# EAGLE design ChakraPendant (EAGLE 7.2.0)
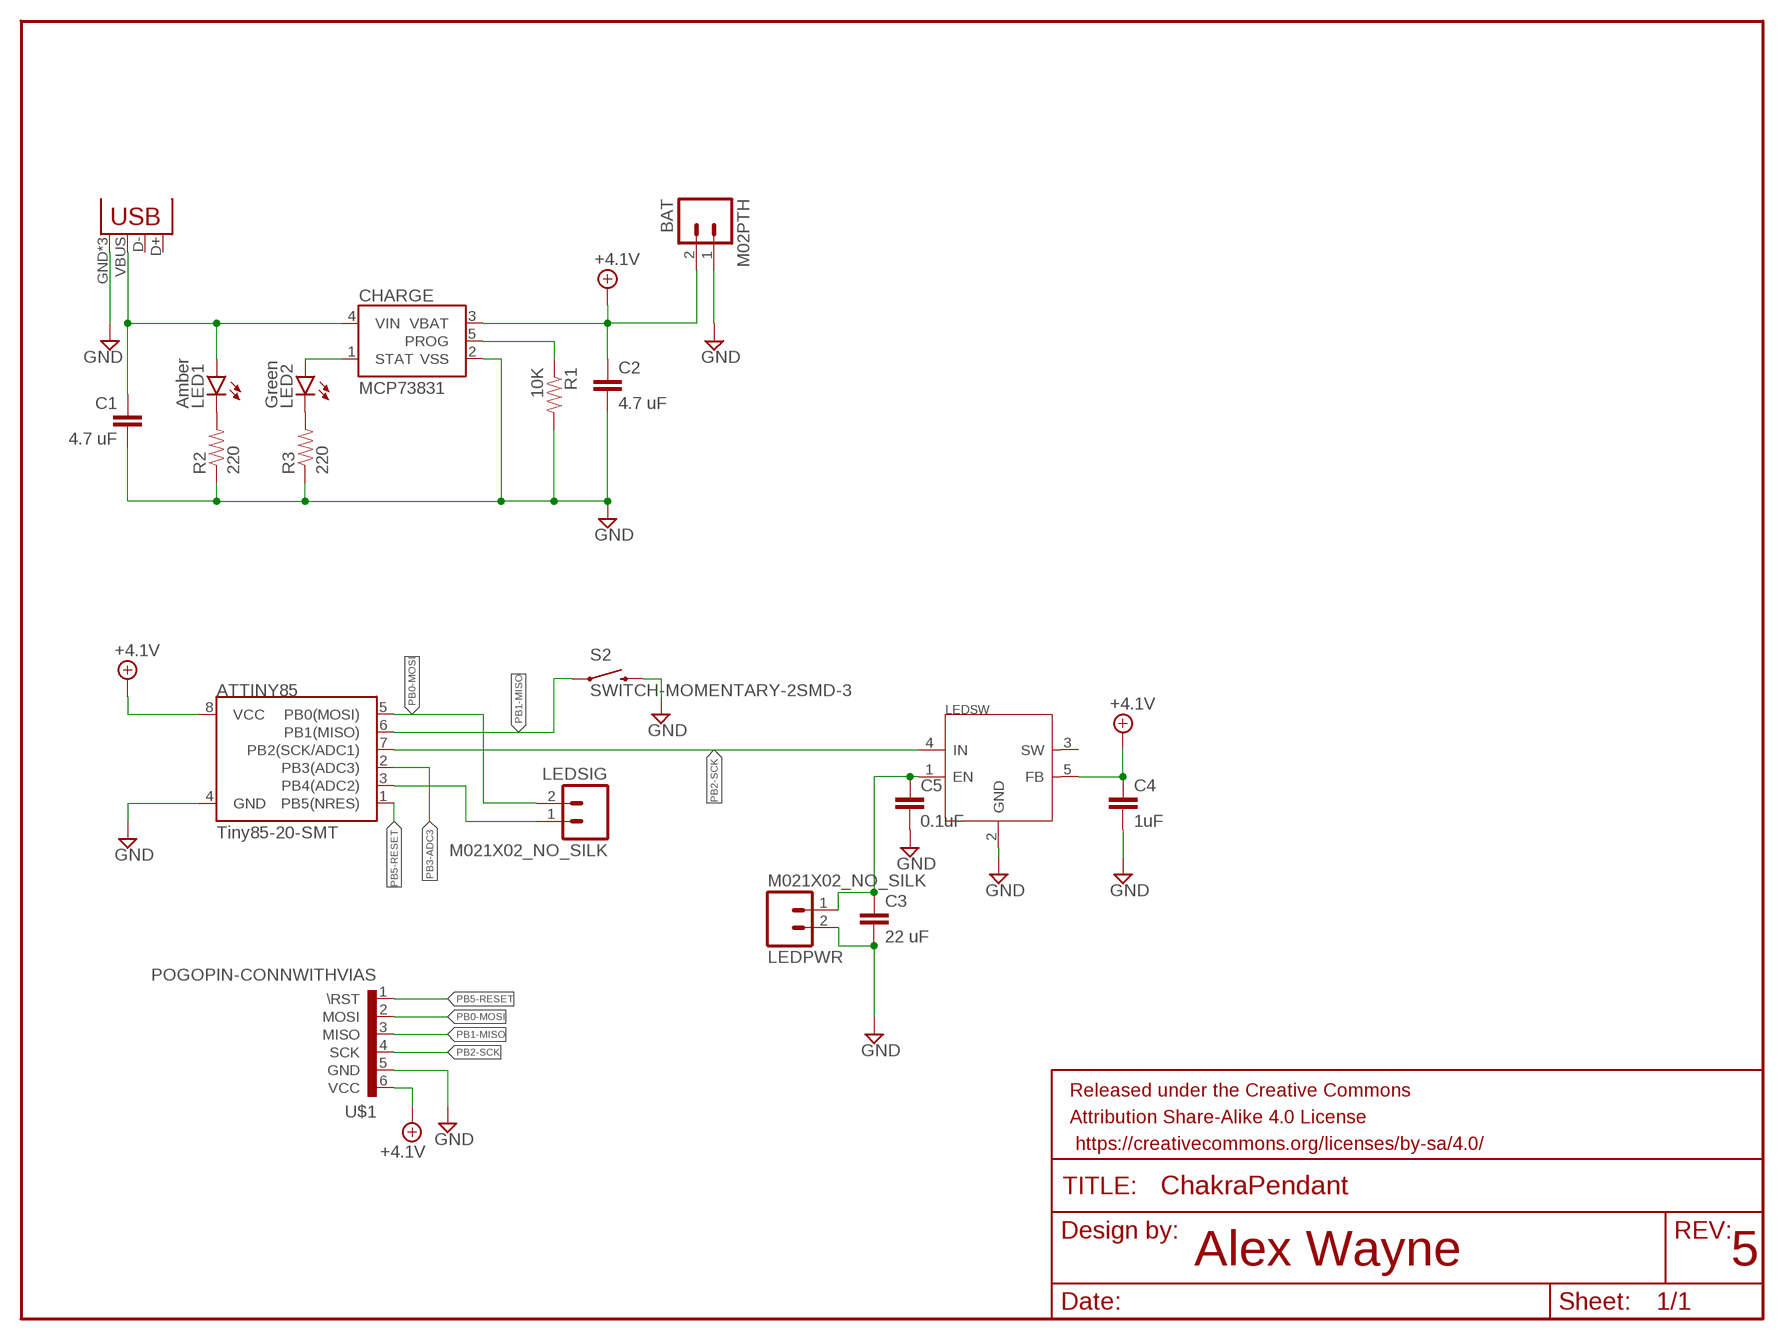
[diagram p0: schematic, sheet 1]

## Parts
ATTINY85  Tiny85-20-SMT  ATTINY45TINY85-20-SMT  [SO08-EIAJ]
BAT  M02PTH  [1X02]
C1  4.7 uF  CAP0603-CAP  [0603-CAP]
C2  4.7 uF  CAP0603-CAP  [0603-CAP]
C3  22 uF  CAP1206  [1206]
C4  1uF  CAP0603-CAP  [0603-CAP]
C5  0.1uF  CAP0603-CAP  [0603-CAP]
CHARGE  MCP73831  [SOT23-5]
FRAME1  FRAME-LETTER  [CREATIVE_COMMONS]
JP1  USB-MICROB  [USB-MICROB]
LED1  Amber  LED0603  [LED-0603]
LED2  Green  LED0603  [LED-0603]
LEDPWR  M021X02_NO_SILK  [1X02_NO_SILK]
LEDSIG  M021X02_NO_SILK  [1X02_NO_SILK]
LEDSW  ETA3406  [SOT23-5]
R1  10K  RESISTOR0603-RES  [0603-RES]
R2  220  RESISTOR0603-RES  [0603-RES]
R3  220  RESISTOR0603-RES  [0603-RES]
S2  SWITCH-MOMENTARY-2SMD-3  [TACTILE_SWITCH_SMD-3]
U$1  POGOPIN-CONNWITHVIAS  [POGOPROG-CONN-0H]

## Nets
+4.1V [supply]: ATTINY85.8(VCC) BAT.2 C2.1 C4.1 CHARGE.3(VBAT) LEDSW.5(FB) U$1.6(VCC)
GND [supply]: ATTINY85.4(GND) BAT.1 C1.2 C2.2 C3.2 C4.2 C5.2 CHARGE.2(VSS) JP1.GND JP1.MT1(GND) JP1.MT2(GND) LEDPWR.2 LEDSW.2(GND) R1.2 R2.1 R3.1 S2.4 U$1.5(GND)
N$3: ATTINY85.3(PB4(ADC2)) LEDSIG.1
N$4: LED1.C R2.2
N$5: LED2.C R3.2
N$6 [supply]: C3.1 C5.1 LEDPWR.1 LEDSW.1(EN)
PB0-MOSI: ATTINY85.5(PB0(MOSI)) LEDSIG.2 U$1.2(MOSI)
PB1-MISO: ATTINY85.6(PB1(MISO)) S2.1 U$1.3(MISO)
PB2-SCK: ATTINY85.7(PB2(SCK/ADC1)) LEDSW.4(IN) U$1.4(SCK)
PB3-ADC3: ATTINY85.2(PB3(ADC3))
PB5-RESET: ATTINY85.1(PB5(NRES)) U$1.1(\RST)
PROG: CHARGE.5(PROG) R1.1
STAT: CHARGE.1(STAT) LED2.A
USB5V [supply]: C1.1 CHARGE.4(VIN) JP1.VBUS LED1.A
Unconnected: JP1.D+ JP1.D- LEDSW.3(SW)

## Notes on the sheet
- Alex Wayne | 5

## Library data of the parts
ATTINY85 = SparkFun-DigitalIC:ATTINY45: Atmel 8-pin 2/4/8kB flash uC; PROD_ID: IC-09092
BAT LEDPWR LEDSIG = SparkFun-Connectors:M02: Standard 2-pin 0.1" header. Use with - straight break away headers ( PRT-00116) - right angle break away headers (PRT-00553) - swiss pins (PRT-00743) - machine pins (PRT-00117) - female headers (PRT-00115) Molex polarized connector foot print use with: PRT-08233 with associated crimp pins and housings. 2.54_SCREWTERM for use with PRT-10571. 3.5mm Screw Terminal footprints for PRT-08084 5mm Screw Terminal footprints for use with PRT-08432
C1-C5 = SparkFun-Passives:CAP: Capacitor Standard 0603 ceramic capacitor, and 0.1" leaded capacitor.
CHARGE = SparkFun-PowerIC:MCP73831: Miniature single cell, fully integrated Li-Ion, Li-polymer charge management controller http://ww1.microchip.com/downloads/en/DeviceDoc/21984a.pdf IC-09995; PROD_ID: IC-09995
FRAME1 = SparkFun-Aesthetics:FRAME-LETTER: Schematic Frame Standard 8.5x11 US Letter frame
JP1 = SparkFun-Connectors:USB: USB Connectors USB-B-PTH is fully proven SKU : PRT-00139/CONN-08278 USB-miniB is fully proven SKU : PRT-00587 USB-A-PCB is untested. USB-A-H is throughly reviewed, but untested. Spark Fun Electronics SKU : PRT-00437 USB-B-SMT is throughly reviewed, but untested. Needs silkscreen touching up. USB-A-S has not been used/tested USB-MB-H has not been used/tested USB-MICROB has been used. CONN-09505; PROD_ID: CONN-09505
LED1 LED2 = SparkFun-LED:LED: LEDs Standard schematic elements and footprints for 5mm, 3mm, 1206, and 0603 sized LEDs. 5mm - Spark Fun Electronics SKU : COM-00529 (and others)
LEDSW = IC:ETA3406: 1.5MHZ 1.2A Step-Down Converter in SOT23-5 Package
R1-R3 = SparkFun-Passives:RESISTOR: Resistor Basic schematic elements and footprints for 0603, 1206, and PTH resistors.
S2 = SparkFun-Electromechanical:SWITCH-MOMENTARY-2: Various NO switches- pushbuttons, reed, etc
U$1 = Protofusion:POGOPIN-CONN: Protofusion custom pogo pin programming header

## Net classes
0 default: width 0.254 mm
1 supply: width 0.508 mm

## Board
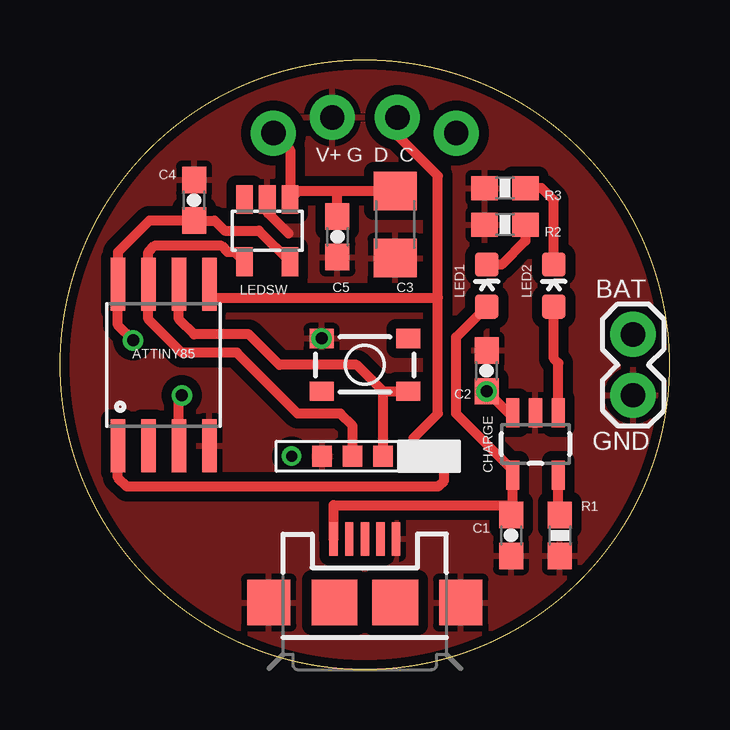
[diagram p1: board, top side]
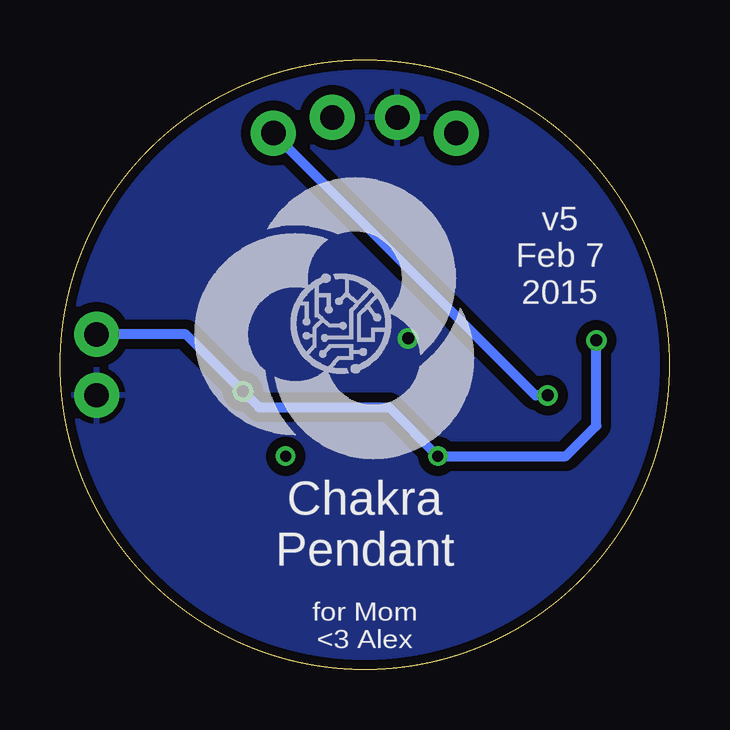
[diagram p2: board, bottom side, seen from below]

Size 25.4 x 25.4 mm. Coordinates in mm from the lower left corner, seen from the top.
Outline: circle at 12.7,12.7 radius 12.7
Copper layers (1*16): Top 0.0356mm / dielectric 1.5011mm / Bottom 0.0356mm
Design rules "oshpark-2layer *": minimum track width 6mil, minimum drill 13mil, track to track 6mil, track to pad 6mil, pad to pad 6mil, via to via 6mil, smd to smd 6mil, copper to edge 15mil, drill to drill 6mil, minimum pad ring 7mil, minimum via ring 7mil, stop-mask expansion 4mil, vias tented up to drill 0mil, thermal gap 10mil

### Footprints (pad centres in the part's own frame; a part is rotated, then mirrored left to right if it is on the bottom)
SO08-EIAJ = smd 0.61 x 2.21: 1 -1.905,-3.378; 2 -0.635,-3.378; 3 0.635,-3.378; 4 1.905,-3.378; 5 1.905,3.353; 6 0.635,3.353; 7 -0.635,3.353; 8 -1.905,3.353
1X02 = drill 1.016 pad 1.88: 1 0,0; 2 2.54,0
0603-CAP = smd 1.1 x 1: 1 -0.85,0; 2 0.85,0
1206 = smd 1.6 x 1.8: 1 -1.4,0; 2 1.4,0
SOT23-5 = smd 0.55 x 1.2: 1 -0.95,-1.3; 2 0,-1.3; 3 0.95,-1.3; 4 0.95,1.3; 5 -0.95,1.3
USB-MICROB = smd 0.35 x 1.4: D+ 0,2.65; D- -0.65,2.65; GND 1.3,2.65; ID 0.65,2.65; VBUS -1.3,2.65 | smd 1.8 x 1.9: MT1 -4,0; MT2 4,0 | smd 1.9 x 1.9: P$1 -1.27,0; P$2 1.27,0
LED-0603 = smd 1 x 1: A 0,-0.877; C 0,0.877
1X02_NO_SILK = drill 1.016 pad 1.88: 1 0,0; 2 2.54,0
SOT23-5' = smd 0.69 x 1.2: 1 -0.95,-1.3; 2 0,-1.3; 3 0.95,-1.3; 4 0.95,1.3; 5 -0.95,1.3
0603-RES = smd 1.1 x 1: 1 -0.85,0; 2 0.85,0
TACTILE_SWITCH_SMD-3 = smd 1 x 0.8: 1 -1.8,1.1; 2 1.8,1.1; 3 -1.8,-1.1; 4 1.8,-1.1
POGOPROG-CONN-0H = drill 0.457: 1 0,3.81; 6 0,-2.54 | smd 0.889 x 0.813: 2 0,2.54; 3 0,1.27; 4 0,0; 5 0,-1.27

### Placement (x,y rotation side)
ATTINY85  4.32,12.7 0 top
BAT  23.88,11.43 90 top
C1  18.8,5.59 270 top
C2  17.78,12.45 90 top
C3  13.97,18.54 270 top
C4  5.59,19.56 90 top
C5  11.56,18.03 270 top
CHARGE  19.81,9.4 180 top
FRAME1  20.83,-21.08 0 top  (outside the outline)
JP1  12.7,2.79 0 top
LED1  17.78,16 0 top
LED2  20.57,16 0 top
LEDPWR  8.89,22.35 15 top
LEDSIG  16.51,22.35 165 top
LEDSW  [SOT23-5']  8.64,18.29 180 top
R1  20.83,5.59 270 top
R2  18.54,18.54 0 top
R3  18.54,20.07 0 top
S2  12.7,12.7 180 top
U$1  12.19,8.89 270 top

### Tracks (layer width: path | path; a pad name or v marks a point on that pad's centre or on a via)
+4.1V  (via drill 0.5)
  Top 0.406: CHARGE.3 18.68,10.7 C2.1 | v3.05,13.72 2.41,14.35 ATTINY85.8 2.41,17.4 3.72,18.71 C4.1 6.44,18.71 6.86,18.29 8.29,18.29 LEDSW.5
  Bottom 0.406: BAT.2 20.15,13.97 C2.1 17.11,10.92 11.68,10.92 U$1.6 4.32,8.89 3.05,10.16 v3.05,13.72
  other vias: 17.78,11.6
GND  (via drill 0.5)
  Top 0.406: LEDSW.2 8.64,19.05 9.53,18.16
  other vias: 10.9,13.8
  pour Top (isolate 0.406): 0,25.4 25.4,25.4 25.4,0 0,0
  pour Bottom (isolate 0.406): 0,25.4 25.4,25.4 25.4,0 0,0
N$3  (via drill 0.5)
  Top 0.406: ATTINY85.3 4.95,11.3 v5.08,11.43
  Bottom 0.406: v5.08,11.43 5.59,11.43 LEDSIG.1
N$4
  Top 0.406: R2.2 19.39,17.87 18.4,16.88 LED1.C
N$5
  Top 0.406: LED2.C 20.57,19.56 20.07,20.07 R3.2
N$6
  Top 0.406: 11.56,19.94 9.94,19.94 LEDSW.1 9.59,21.66 LEDPWR.1 | 11.56,19.94 C3.1 | C5.1 11.56,19.94
PB0-MOSI
  Top 0.406: U$1.2 14.73,9.65 15.75,10.67 15.75,15.49 | 15.75,15.49 6.22,15.49 ATTINY85.5 | 15.75,15.49 15.75,20.57 14.06,22.27 LEDSIG.2
PB1-MISO
  Top 0.406: 14.05,11.6 S2.1 13.46,11.6 | U$1.3 13.46,11.6 | ATTINY85.6 4.95,14.61 5.59,13.97 7.87,13.97 9.14,12.7 12.36,12.7 13.46,11.6
PB2-SCK
  Top 0.406: U$1.4 12.19,10.16 11.68,10.67 9.91,10.67 7.37,13.21 5.08,13.21 3.68,14.61 ATTINY85.7 3.68,17.4 3.94,17.65 6.73,17.65 6.99,17.4 7.28,17.4 LEDSW.4
PB5-RESET
  Top 0.406: ATTINY85.1 2.41,8 2.79,7.62 15.75,7.62 16,7.87 U$1.1
PROG
  Top 0.406: R1.1 20.76,6.44 CHARGE.5
STAT
  Top 0.406: CHARGE.1 20.76,12.77 20.57,12.95 LED2.A
USB5V
  Top 0.406: JP1.VBUS 11.4,6.86 18.8,6.86 C1.1 arc90 18.86,6.5 CHARGE.4 18.86,8.32 16.51,10.67 16.51,13.86 LED1.A

### Text on the board
tNames: V+ G D C | GND
bNames: v5 / Feb 7 / 2015 | Chakra / Pendant | for Mom / <3 Alex